# Altium project PCB_BALAM_21.PrjPcb
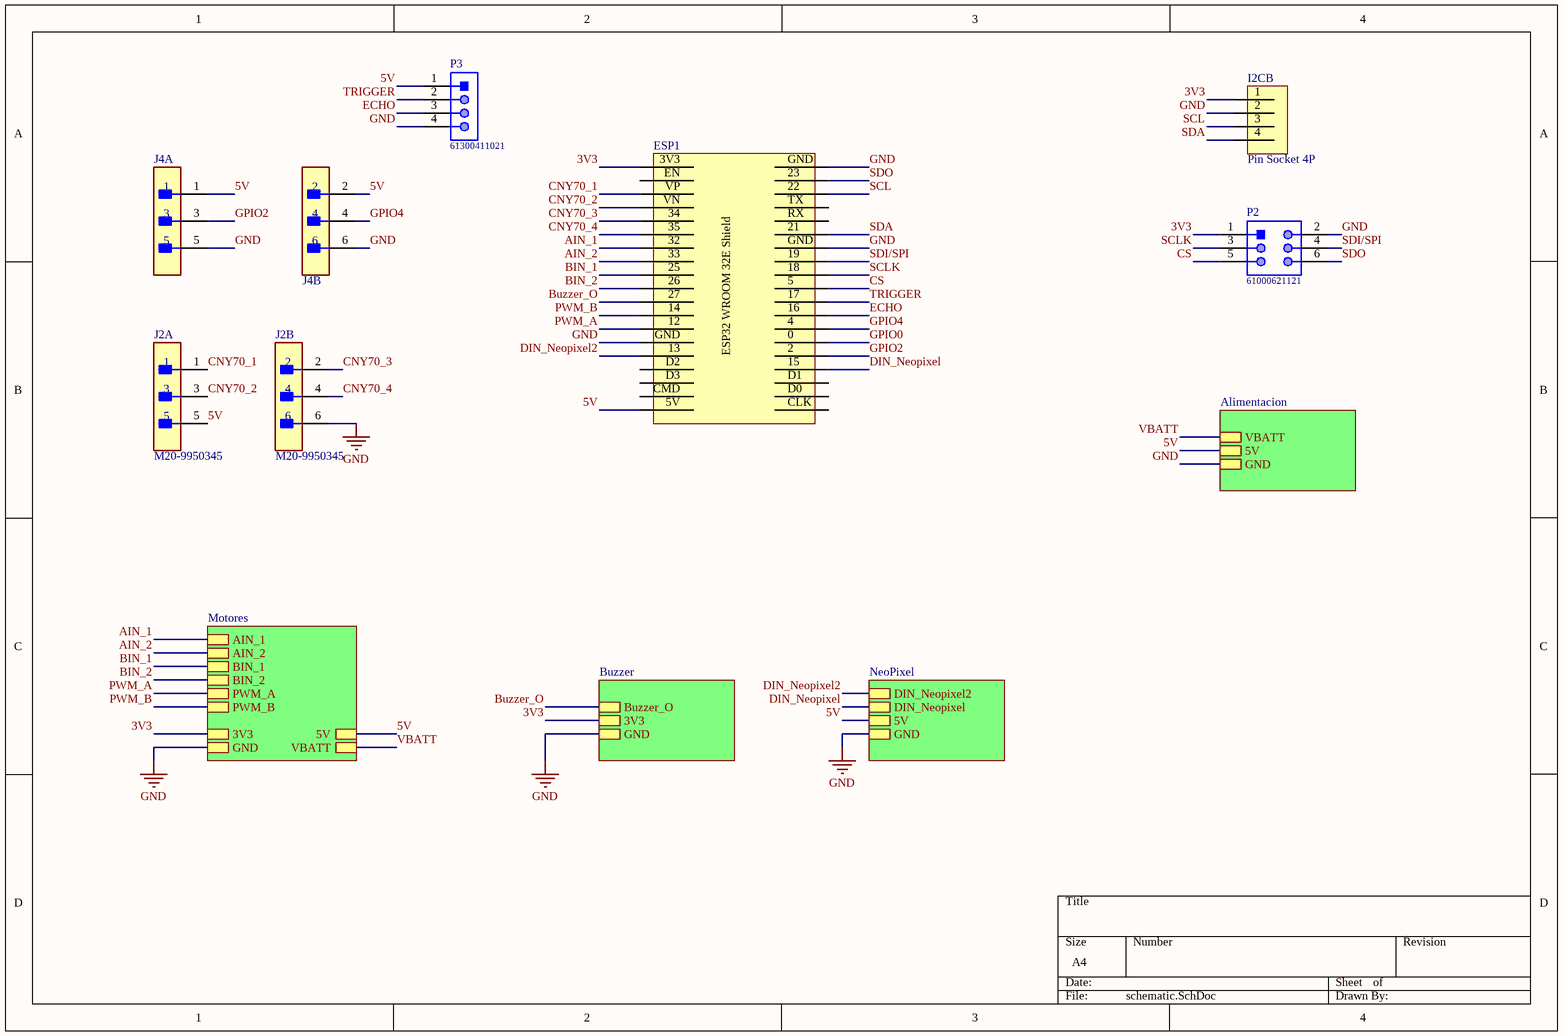
[diagram p0: schematic.SchDoc]
5 sheets, 46 parts. Net scope: hierarchical (ports join the sheet entries above them; power ports are global).
Board files: Balam_Board_2021_V2.PcbDoc, Balam_Board_2021.PcbDoc
Sheets:
  schematic.SchDoc
    NeoPixel = NeoPixel.SchDoc
    Buzzer = Buzzer.SchDoc
    Motores = Motores.SchDoc
    Alimentacion = Alimentacion.SchDoc

## Sheet schematic.SchDoc
size A4; SheetNumber: 1; SheetTotal: 5

### Parts
ESP1  Shield_ESP32_WR32E  [Shield_ESP32_WR32E]  (value not drawn)
I2C  Pin Socket 4P  [Pin Socket 4P]  (part B of 2)
J2  M20-9950345  [FP-M20-9950345-MFG]  (parts A,B of 2)
J4  M20-9950345  [FP-M20-9950345-MFG]  (value not drawn)  (parts A,B of 2)
P2  61000621121  [61000621121]
P3  61300411021  [61300411021]

### Sub-sheets
Alimentacion = Alimentacion.SchDoc: VBATT, GND, 5V
Buzzer = Buzzer.SchDoc: GND, 3V3, Buzzer_O
Motores = Motores.SchDoc: AIN_1, BIN_1, GND, AIN_2, PWM_B, 3V3, PWM_A, BIN_2, 5V, VBATT
NeoPixel = NeoPixel.SchDoc: DIN_Neopixel, GND, 5V, DIN_Neopixel2

### Nets
3V3: ESP1.3V3 I2C.1 P2.1 ; sheet Buzzer/3V3, sheet Motores/3V3
5V: ESP1.5V J2.5 J4.1 J4.2 P3.1 ; sheet NeoPixel/5V, sheet Motores/5V, sheet Alimentacion/5V
GND: ESP1.GND I2C.2 J2.6 J4.5 J4.6 P2.2 P3.4 ; sheet NeoPixel/GND, sheet Buzzer/GND, sheet Motores/GND, sheet Alimentacion/GND
AIN_1: ESP1.32 ; sheet Motores/AIN_1
AIN_2: ESP1.33 ; sheet Motores/AIN_2
BIN_1: ESP1.25 ; sheet Motores/BIN_1
BIN_2: ESP1.26 ; sheet Motores/BIN_2
Buzzer_O: ESP1.27 ; sheet Buzzer/Buzzer_O
CNY70_1: ESP1.VP J2.1
CNY70_2: ESP1.VN J2.3
CNY70_3: ESP1.34 J2.2
CNY70_4: ESP1.35 J2.4
CS: ESP1.5 P2.5
DIN_Neopixel: ESP1.15 ; sheet NeoPixel/DIN_Neopixel
DIN_Neopixel2: ESP1.13 ; sheet NeoPixel/DIN_Neopixel2
ECHO: ESP1.16 P3.3
GPIO0: ESP1.0
GPIO2: ESP1.2 J4.3
GPIO4: ESP1.4 J4.4
PWM_A: ESP1.12 ; sheet Motores/PWM_A
PWM_B: ESP1.14 ; sheet Motores/PWM_B
SCL: ESP1.22 I2C.3
SCLK: ESP1.18 P2.3
SDA: ESP1.21 I2C.4
SDI/SPI: ESP1.19 P2.4
SDO: ESP1.23 P2.6
TRIGGER: ESP1.17 P3.2
VBATT: sheet Motores/VBATT, sheet Alimentacion/VBATT

Not connected (* = marked no-connect by the designer): ESP1 CLK CMD D0 D1 D2 D3 EN RX TX

### Notes on the sheet
- (in symbol Shield_ESP32_WR32E) ESP32 WROOM 32E Shield

### Library data of the parts
I2C = Pin Socket 4P: Female Header 4 1 Straight，180degrees 2.54mm Through Hole,P=2.54mm Pin Header & Female Header RoHS
J2 J4 = CMP-15831-000002-1: CONN HEADER R/A 6POS 2.54MM; Manufacturer: Harwin; Conn Gender: Male; Number Of Contacts: 6; Conn Orientation: Right Angle; Current Rating: 3A; Device Class L2: Headers and Wire Housings; Temperature: -40°C to +105°C; Device Class L1: Connectors; RoHS: TRUE; Temperature Range Low: -40°C; ComponentLink2URL: https://cdn.harwin.com/pdfs/M20-995.pdf; Height: 5.28mm; Digikey Description: CONN HEADER R/A 6POS 2.54MM; Pitch: 2.54mm; Manufacturer Part Number: M20-9950345; Device Class L3: unset; Ipc Land Pattern Name: DFN400X400X80-14; Automotive: No; Octopart: https://octopart.com/m20-9950345-harwin-21265213; Category: Conn; Mouser Description: Headers & Wire Housings 03+03 DIL HORIZONTAL PIN HEADER GOLD HT; Package: 0; Number Of Rows: 2; Contact Material: Gold,Nickel; Lead Free: Yes; ComponentLink2Description: Datasheet; Temperature Range High: +105°C
P2 = CMP-1502-01024-1: SMT Vertical Pin Header WR-PHD, Pitch 2.54 mm, Dual Row, 6 pins; Manufacturer: Wurth Elektronik; Withstanding Voltage: 500VAC; Contact Resistance: 20mOhm; Working Voltage: 250VAC; Gender: Male; Rated Current: 3A; Pin Number: 6; Pitch: 2.54mm; Part Number: 61000621121; Operating Temperature: -40to125degC; Mounting Technology: SMT; Packaging: Tube; Datasheet URL: https://katalog.we-online.de/em/datasheet/6100xx21121.pdf; Package Reference: 61000621121; Publisher: WurthElektronik; Row Number: Dual; Orientation: Vertical; Manufacturer URL: http://www.we-online.de
P3 = CMP-1502-01063-1: THT Angled Pin Header WR-PHD, Pitch 2.54 mm, Single Row, 4 pins; Manufacturer: Wurth Elektronik; Gender: Male; Pin Number: 4; Withstanding Voltage: 500VAC; Working Voltage: 250VAC; Contact Resistance: 20mOhm; Pitch: 2.54mm; Rated Current: 3A; Manufacturer URL: http://www.we-online.de; Mounting Technology: THT; Publisher: WurthElektronik; Operating Temperature: -40to105degC; Packaging: Bag; Row Number: Single; Package Reference: 61300411021; Part Number: 61300411021; Orientation: Angled; Datasheet URL: https://katalog.we-online.de/em/datasheet/6130xx11021.pdf

## Sheet NeoPixel.SchDoc
size A4; SheetNumber: 2; SheetTotal: 6
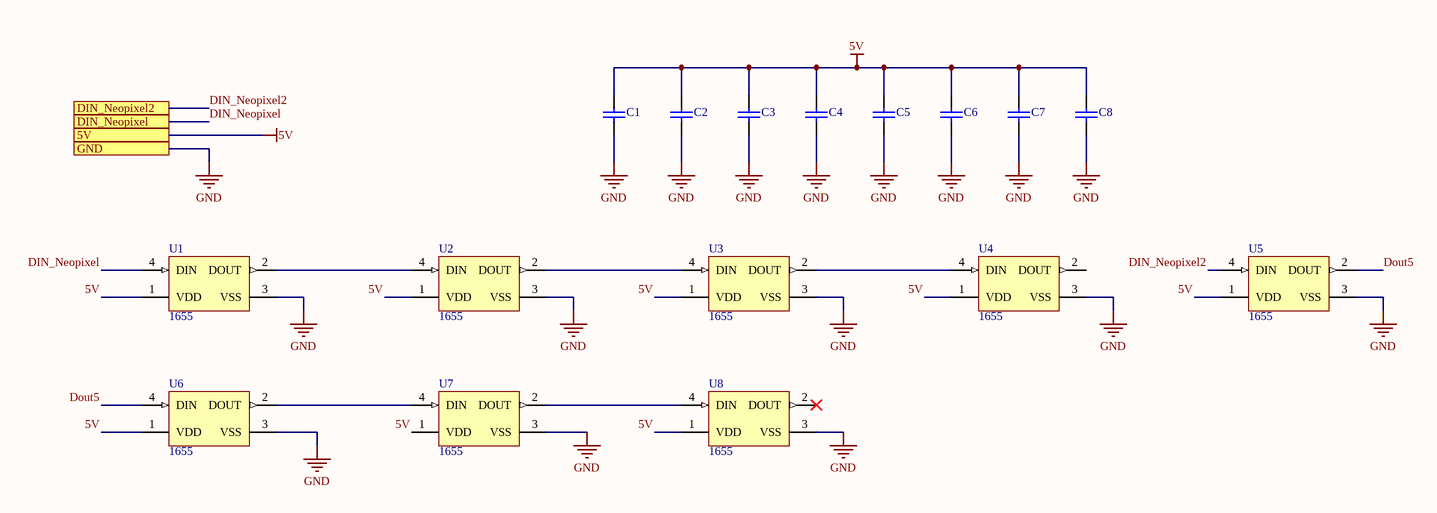
[diagram p1: NeoPixel.SchDoc]

### Parts
C1  C0805C105Z4VACTU  [CAPC2013X140X50ML20T25]  (value not drawn)
C2  C0805C105Z4VACTU  [CAPC2013X140X50ML20T25]  (value not drawn)
C3  C0805C105Z4VACTU  [CAPC2013X140X50ML20T25]  (value not drawn)
C4  C0805C105Z4VACTU  [CAPC2013X140X50ML20T25]  (value not drawn)
C5  C0805C105Z4VACTU  [CAPC2013X140X50ML20T25]  (value not drawn)
C6  C0805C105Z4VACTU  [CAPC2013X140X50ML20T25]  (value not drawn)
C7  C0805C105Z4VACTU  [CAPC2013X140X50ML20T25]  (value not drawn)
C8  C0805C105Z4VACTU  [CAPC2013X140X50ML20T25]  (value not drawn)
U1  1655  [ADA-RGB-1655_V]
U2  1655  [ADA-RGB-1655_V]
U3  1655  [ADA-RGB-1655_V]
U4  1655  [ADA-RGB-1655_V]
U5  1655  [ADA-RGB-1655_V]
U6  1655  [ADA-RGB-1655_V]
U7  1655  [ADA-RGB-1655_V]
U8  1655  [ADA-RGB-1655_V]

### Ports
5V, DIN_Neopixel, DIN_Neopixel2, GND

### Nets
5V: C1.2 C2.2 C3.2 C4.2 C5.2 C6.2 C7.2 C8.2 U1.1(VDD) U2.1(VDD) U3.1(VDD) U4.1(VDD) U5.1(VDD) U6.1(VDD) U7.1(VDD) U8.1(VDD) ; port 5V
GND: C1.1 C2.1 C3.1 C4.1 C5.1 C6.1 C7.1 C8.1 U1.3(VSS) U2.3(VSS) U3.3(VSS) U4.3(VSS) U5.3(VSS) U6.3(VSS) U7.3(VSS) U8.3(VSS) ; port GND
DIN_Neopixel: U1.4(DIN) ; port DIN_Neopixel
DIN_Neopixel2: U5.4(DIN) ; port DIN_Neopixel2
Dout5: U5.2(DOUT) U6.4(DIN)
NetU1_2: U1.2(DOUT) U2.4(DIN)
NetU2_2: U2.2(DOUT) U3.4(DIN)
NetU3_2: U3.2(DOUT) U4.4(DIN)
NetU6_2: U6.2(DOUT) U7.4(DIN)
NetU7_2: U7.2(DOUT) U8.4(DIN)

Not connected (* = marked no-connect by the designer): U4 2(DOUT); U8 2(DOUT)*

### Library data of the parts
C1-C8 = CMP-2007-03241-1: Manufacturer: Kemet; Part Number: C0805C105Z4VACTU
U1-U8 = CMP-2000-05026-1: Intelligent Control LED Integrated Light Source, 3.5 to 5.3 V, -25 to 80 degC, 4-Pin SMD, RoHS, Tape and Reel; Manufacturer: Adafruit-Industries-LLC; Number of LEDs: 10; Configuration: Discrete; Utilized LED: WS2812(5050); Datasheet URL: http://datasheet.octopart.com/ADA1655-Adafruit-Industries-datasheet-32028139.pdf; Series: Neopixel; Interface: -; Package Description: 4-Pin Surface Mount Device, Body 5 x 5 mm; Color: Red,Green,Blue(RGB); Category: Optoelectronics; Controller Type: -; Package Reference: 1655; Manufacturer URL: https://www.adafruit.com/; Mounting Type: SurfaceMount; Datasheet Version: May-13; Size / Dimension: 5.00mmLx5.00mmW; Family: Addressable,Specialty

## Sheet Buzzer.SchDoc
size A4; SheetNumber: 3; SheetTotal: 5
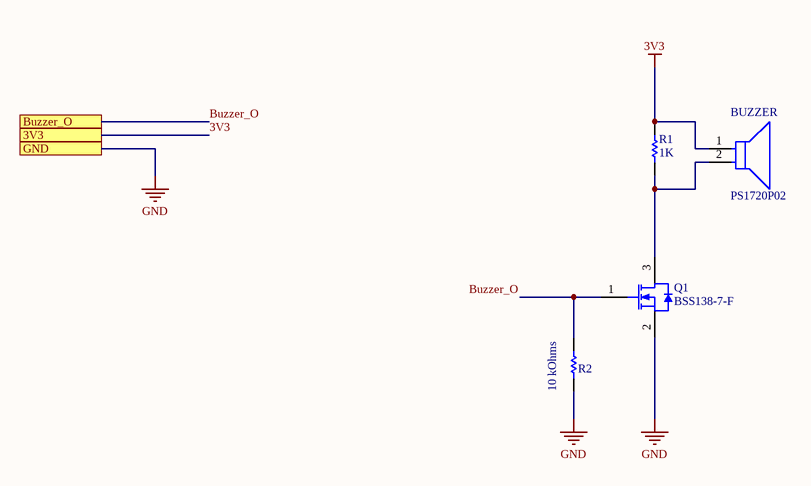
[diagram p2: Buzzer.SchDoc]

### Parts
BUZZER  PS1720P02  [FP-PS1720P02-MFG]
Q1  BSS138-7-F  [DIOD-SOT23-3_V]
R1  1K  [RESC0805(2012)_M]
R2  10 kOhms  [RESC2013X60X30ML20T20]

### Ports
3V3, Buzzer_O, GND

### Nets
3V3: BUZZER.1 R1.2 ; port 3V3
GND: Q1.2(S) R2.2 ; port GND
Buzzer_O: Q1.1(G) R2.1 ; port Buzzer_O
NetBUZZER_2: BUZZER.2 Q1.3(D) R1.1

### Library data of the parts
BUZZER = CMP-08413-000001-1: AUDIO PIEZO TRANSDUCER 30V TH; Manufacturer: TDK Corporation; Frequency: 2kHz; Standoff Height: 0.5mm; RoHS: TRUE; ComponentLink2URL: https://product.tdk.com/info/en/catalog/datasheets/piezoelectronic_buzzer_ps_en.pdf; ComponentLink2Description: Datasheet; Lead Free: Yes; Temperature Range High: +70°C; Category: Speak; Height: 8.3mm; Device Class L1: Electromechanical; Device Class L3: Buzzers; Package: 0; Mouser Description: Audio Indicators & Alerts Round 17mmx8mm 2 kHz Vin=3V; Manufacturer Part Number: PS1720P02; Digikey Description: AUDIO PIEZO TRANSDUCER 30V TH; Device Class L2: Audio Products; Temperature Range Low: -10°C; Automotive: No; Octopart: https://octopart.com/ps1720p02-tdk-154429; Temperature: -10°C to +70°C
Q1 = CMP-2000-04930-1: N-Channel Enhancement Mode Mosfet, 50 V, 0.2 A, -55 to 150 degC, 3-Pin SOT23, RoHS, Tape and Reel; Manufacturer: Diodes Inc; Brand: DiodesIncorporated; Unit Weight: 0.000282oz; Pd - Power Dissipation: 300mW; Id - Continuous Drain Current: 200mA; Rds On - Drain-Source Resistance: 3.5Ohms; Vgs - Gate-Source Voltage: 20V; Number of Channels: 1Channel; Vds - Drain-Source Breakdown Voltage: 50V; Transistor Type: 1N-Channel; Typical Turn-Off Delay Time: 20ns; Configuration: Single; Mounting Style: SMD/SMT; Height: 1mm; Package Description: 3-Pin Small Outline Transistor, Body 2.9 x 1.3 mm, Pitch 0.96 mm; Datasheet Version: Rev. 20-2, 11/2013; Minimum Operating Temperature: -55C; Package / Case: SOT-23-3; Channel Mode: Enhancement; Product: MOSFETSmallSignal; Packaging: Reel; Maximum Operating Temperature: +150C; Datasheet URL: https://datasheet.ciiva.com/8115/ds30144-8115344.pdf; Product Category: MOSFET; Width: 1.3mm; Technology: Si; Package Reference: SOT23-3; Manufacturer URL: http://www.diodes.com/; Transistor Polarity: N-Channel; Length: 2.9mm; Factory Pack Quantity: 3000; Series: BSS138; RoHS: True; Typical Turn-On Delay Time: 20ns
R1 = CMP-1013-00510-1: 1K 0.125W 1% 0805 (2012 Metric)  SMD; Case-Metric: 2012; Value: 1000.00 Ohm; Case-EIA: 0805; Tolerance: 1 %; Power: 0.125 W; Technology: SMT
R2 = CMP-2001-04657-1: 10 kOhms ±5% 0.25W, 1/4W Chip Resistor 0805 (2012 Metric) Automotive AEC-Q200, Moisture Resistant Thick Film; Part Number: RK73B2ATTD103J; Manufacturer: KOA Speer

## Sheet Motores.SchDoc
size A4; SheetNumber: 4; SheetTotal: 6
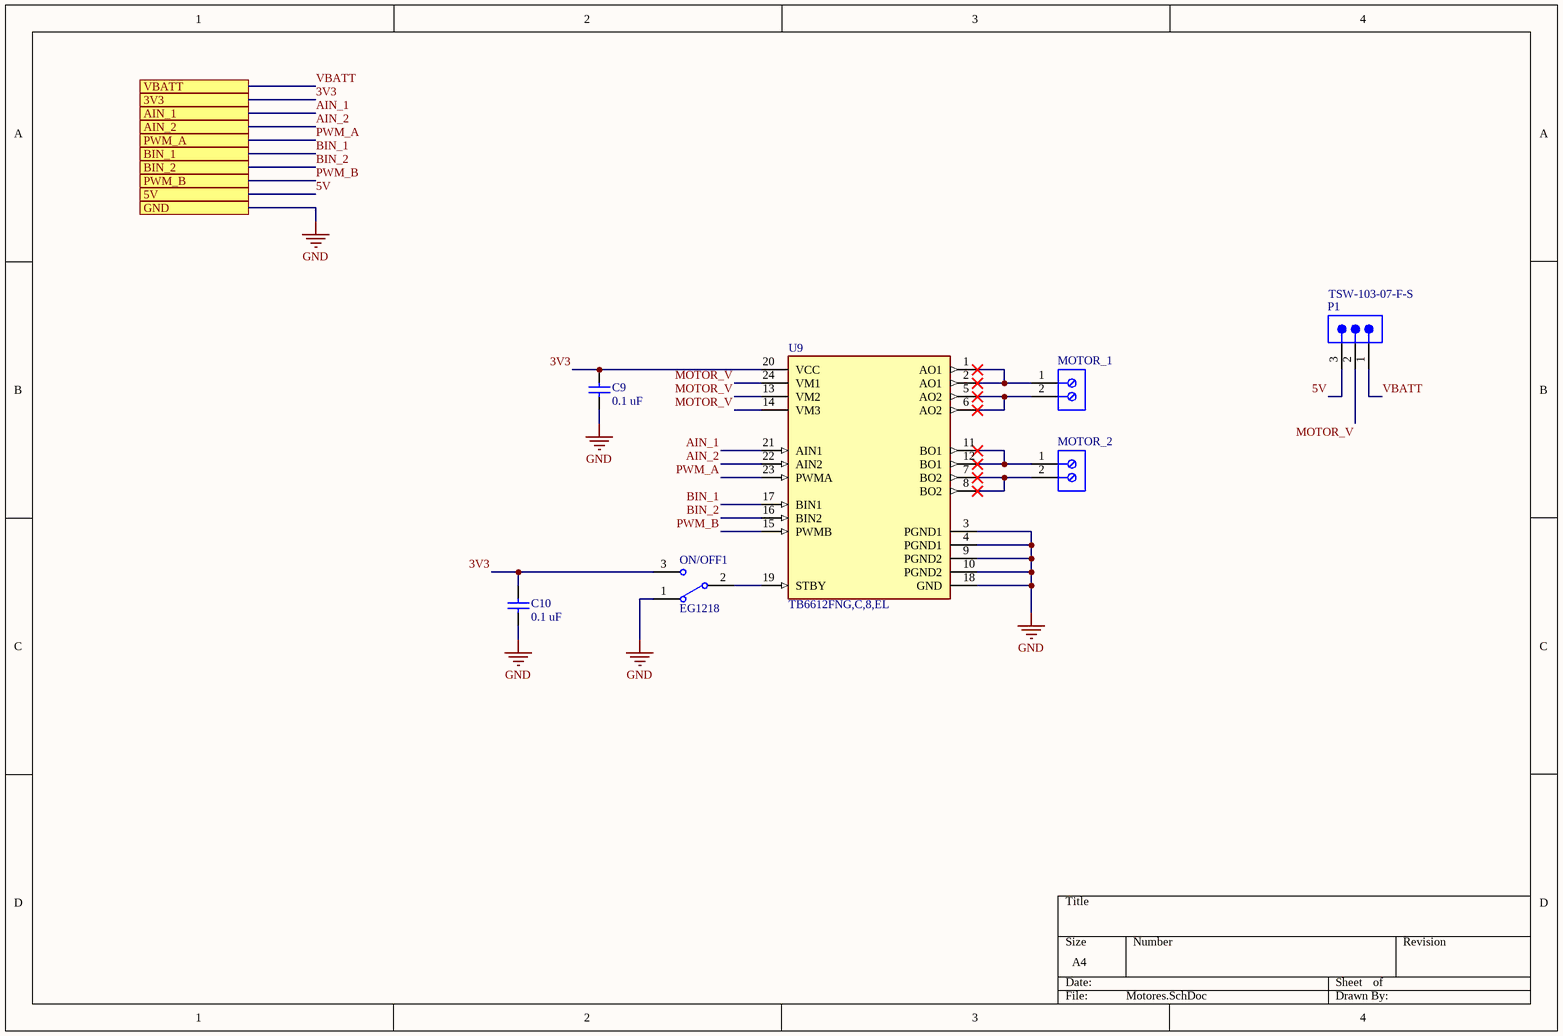
[diagram p3: Motores.SchDoc]

### Parts
C9  0.1 uF  [CAPC2013X94X50ML20T25]
C10  0.1 uF  [CAPC2013X94X50ML20T25]
MOTOR_1  691214110002  [691214110002]  (value not drawn)
MOTOR_2  691214110002  [691214110002]  (value not drawn)
ON/OFF1  EG1218  [ESWI-EG1218_V]
P1  TSW-103-07-F-S  [SMTC-TSW-103-07-X-S]
U9  TB6612FNG,C,8,EL  [FP-SSOP24-P-300-0_65A-IPC_A]

### Ports
3V3, 5V, AIN_1, AIN_2, BIN_1, BIN_2, GND, PWM_A, PWM_B, VBATT

### Nets
3V3: C9.2 C10.2 ON/OFF1.3 U9.20(VCC) ; port 3V3
5V: P1.3 ; port 5V
GND: C9.1 C10.1 ON/OFF1.1 U9.3(PGND1) U9.4(PGND1) U9.9(PGND2) U9.10(PGND2) U9.18(GND) ; port GND
AIN_1: U9.21(AIN1) ; port AIN_1
AIN_2: U9.22(AIN2) ; port AIN_2
BIN_1: U9.17(BIN1) ; port BIN_1
BIN_2: U9.16(BIN2) ; port BIN_2
MOTOR_V: P1.2 U9.13(VM2) U9.14(VM3) U9.24(VM1)
PWM_A: U9.23(PWMA) ; port PWM_A
PWM_B: U9.15(PWMB) ; port PWM_B
VBATT: P1.1 ; port VBATT
NetMOTOR_1_1: MOTOR_1.1 U9.1(AO1) U9.2(AO1)
NetMOTOR_1_2: MOTOR_1.2 U9.5(AO2) U9.6(AO2)
NetMOTOR_2_1: MOTOR_2.1 U9.11(BO1) U9.12(BO1)
NetMOTOR_2_2: MOTOR_2.2 U9.7(BO2) U9.8(BO2)
NetON/OFF1_2: ON/OFF1.2(COM) U9.19(STBY)

### Library data of the parts
C9 C10 = CMP-2000-05016-1: Chip Capacitor, Ceramic, 0.1 uF, 10%, 50 V, 0805, RoHS, Tape and Reel; Manufacturer: AVX; Rated Voltage: 50V; Capacitance: 100nF; Dielectric: X7R; Case Size/Dimension: 0805; Tolerance (%): ±10%; Datasheet URL: http://www.farnell.com/datasheets/319609.pdf; Datasheet Version: Sep-07; Manufacturer URL: http://www.avx.com/
MOTOR_1 MOTOR_2 = CMP-1502-02464-1: Serie 2141 - 3.50 mm Horizontal Entry Modular with Rising Cage Clamp WR-TBL, 2 pin; Manufacturer: Wurth Elektronik; Pin Number: 2; Pitch: 3.50mm; Datasheet URL: http://katalog.we-online.de/em/datasheet/6912141100xx.pdf; Packaging: Box; Mounting Technology: THT; Package Reference: 691214110002; Manufacturer URL: http://www.we-online.de; Part Number: 691214110002; Publisher: WurthElektronik; Operating Temperature: -40to105degC
ON/OFF1 = CMP-1696-00002-1: Slide Switch, 500 V, -20 to 70 degC, 3-Pin THD, RoHS; Case\Package: SOT-23-5; Output Current: 150 mA; Nominal Output Voltage: 3.3 V; Max Power Dissipation: 250 mW; Min Input Voltage: 4.3 V; Outputs: 1; Max Input Voltage: 8 V; Dropout Voltage: 300 mV; PackageDescription: 3-Pin Through Hole Device, Body 11.6 x 4 mm, Pitch 2.5 mm; ComponentLink1URL: http://www.e-switch.ch/en/; RoHSCompliant: true; Length: 3 mm; ComponentLink1Description: Manufacturer URL; Power Rating: 250 mW; Mount: Surface Mount; Max Operating Temperature: 85 degC; REACH SVHC: No SVHC; Radiation Hardening: No; Height: 1.3 mm; Pins: 5; Max Ouput Current: 150 mA; Output Voltage: 3.3 V; Width: 1.8 mm; Package Quantity: 3000; ComponentLink2URL: https://www.e-switch.com/system/asset/product_line/data_sheet/119/EG.pdf; Min Operating Temperature: -40 degC; ComponentLink2Description: Datasheet; DatasheetVersion: Oct-15; PackageReference: EG1218; Packaging: Tape and Reel
P1 = CMP-1024-00331-1: 0.025" SQ Post Header, Through-hole, Vertical, -55 to 125 degC, 2.54 mm Pitch, 3-Pin, Male, RoHS; Manufacturer: Samtec; Pitch: 2.54 mm; DatasheetVersion: F-214; ComponentLink1Description: Manufacturer URL; ComponentLink3URL: http://www.samtec.com/documents/webfiles/cpdf/TSW-XXX-XX-XXX-X-XX-XXX-MKT.pdf; Mounting Technology: Through-hole; PackageDescription: .025[0.64] SQ. Post Terminal Strip Assembly; Temperature Range: -55 to 125 degC; ComponentLink3Description: Package Specification; Orientation: Vertical; PartNumber: TSW-103-07-F-S; RoHS: True; PackageVersion: DM, 8/1988; ComponentLink2Description: Datasheet; ComponentLink1URL: http://www.samtec.com; ComponentLink2URL: http://www.samtec.com/documents/webfiles/pdf/TSW_TH.PDF; PackageReference: TSW-103-07-X-S
U9 = CMP-2100-03693-3: IC MOTOR DRIVER 2.7V-5.5V 24SSOP; Interface: Parallel; Output Current: 1A; Operating Supply Voltage: 3V; Max Supply Voltage: 5.5V; Min Supply Voltage: 2.7V; Number of Outputs: 2; Logic Function: AND; Min Operating Temperature: -20°C; Max Operating Temperature: 85°C; Number of Pins: 24; Package Quantity: 1; Packaging: Tape and Reel; Mount: Surface Mount; Case/Package: SSOP

## Sheet Alimentacion.SchDoc
size A4; SheetNumber: 6; SheetTotal: 6
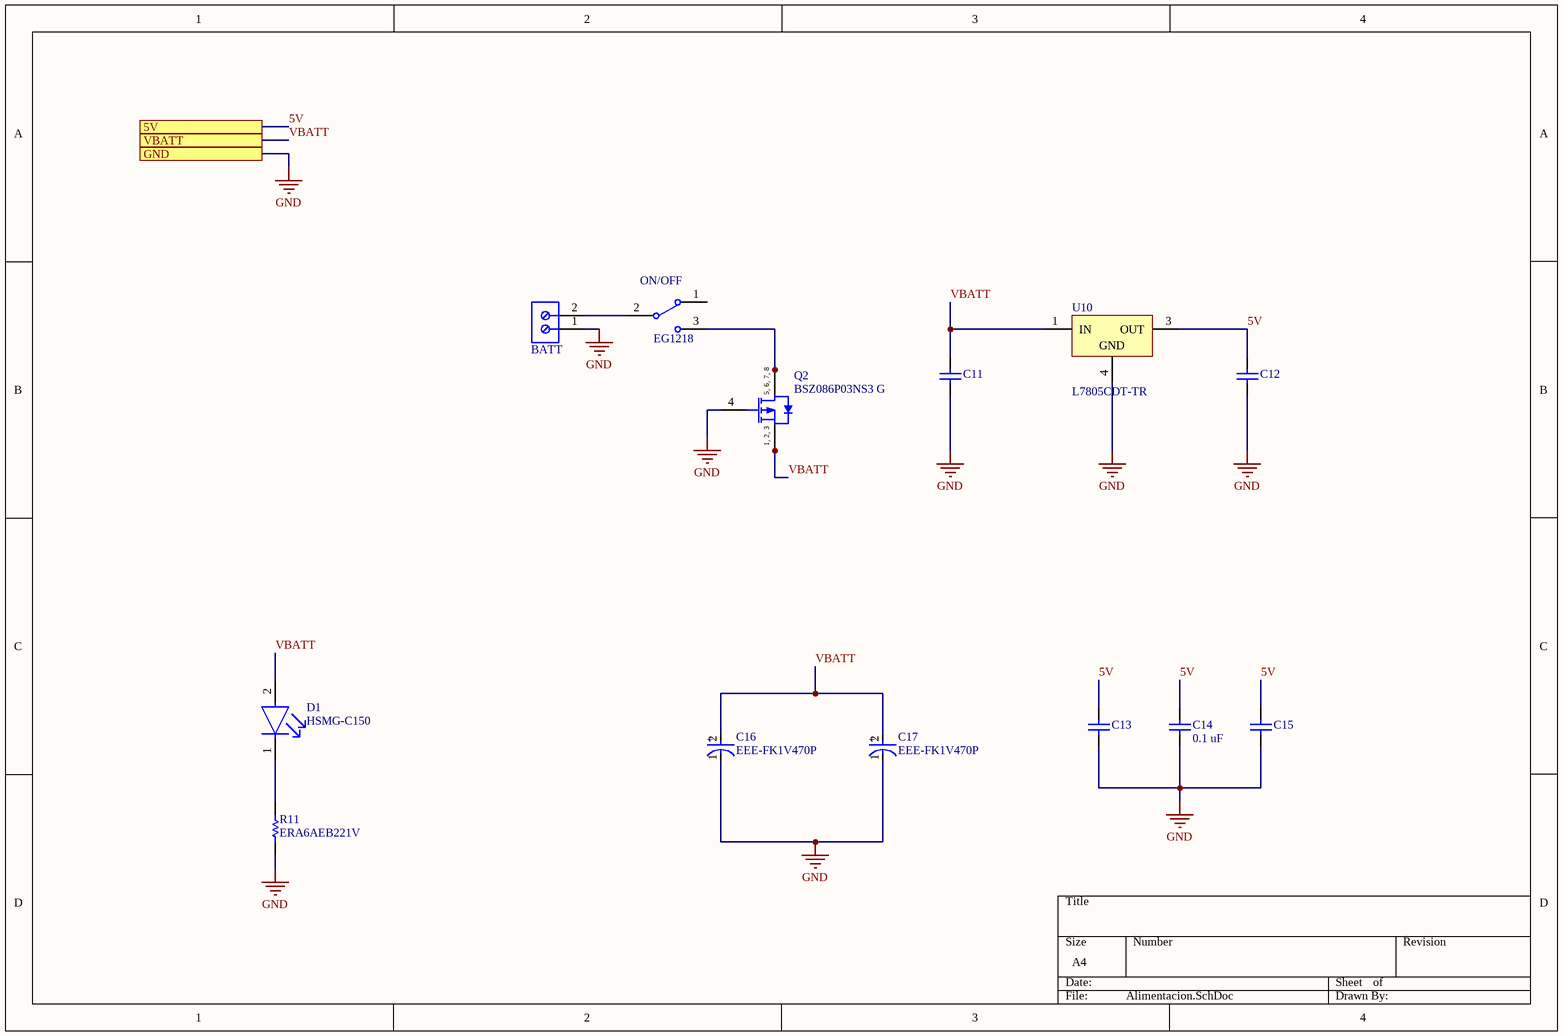
[diagram p4: Alimentacion.SchDoc]

### Parts
BATT  691214110002  [691214110002]  (value not drawn)
C11  C0805C106K4PACTU  [CAPC2013X140X50ML20T25]  (value not drawn)
C12  C0805C106K4PACTU  [CAPC2013X140X50ML20T25]  (value not drawn)
C13  C0805C106K4PACTU  [CAPC2013X140X50ML20T25]  (value not drawn)
C14  0.1 uF  [CAPC2013X94X50ML20T25]
C15  C0805C106K4PACTU  [CAPC2013X140X50ML20T25]  (value not drawn)
C16  EEE-FK1V470P  [FP-FK-D-MFG]
C17  EEE-FK1V470P  [FP-FK-D-MFG]
D1  HSMG-C150  [FP-HSMG-C150-MFG]
ON/OFF  EG1218  [ESWI-EG1218_V]
Q2  BSZ086P03NS3 G  [INF-PG-TSDSON-8-1_V]
R11  ERA6AEB221V  [RESC2013X60X40ML20T25]
U10  L7805CDT-TR  [TO-252_M]

### Ports
5V, GND, VBATT

### Nets
5V: C12.2 C13.2 C14.2 C15.2 U10.3(OUT) ; port 5V
GND: BATT.1 C11.1 C12.1 C13.1 C14.1 C15.1 C16.1(C) C17.1(C) Q2.4(GATE) R11.1 U10.4(GND) ; port GND
VBATT: C11.2 C16.2(A) C17.2(A) D1.2(A) Q2.1(SOURCE) Q2.2(SOURCE) Q2.3(SOURCE) U10.1(IN) ; port VBATT
NetBATT_2: BATT.2 ON/OFF.2(COM)
NetD1_1: D1.1(C) R11.2
NetON/OFF_3: ON/OFF.3 Q2.5(DRAIN) Q2.6(DRAIN) Q2.7(DRAIN) Q2.8(DRAIN)

Not connected (* = marked no-connect by the designer): ON/OFF 1

### Notes on the sheet
- (in symbol CMP-1099-00063-1) 5, 6, 7, 8; 1, 2, 3
- (in symbol CMP-05427-000002-1) +

### Library data of the parts
BATT = CMP-1502-02464-1: as MOTOR_1 on sheet Motores; Datasheet URL: http://katalog.we-online.de/em/datasheet/6912141100xx.pdf; Packaging: Box; Mounting Technology: THT; Package Reference: 691214110002; Manufacturer URL: http://www.we-online.de; Part Number: 691214110002; Publisher: WurthElektronik; Operating Temperature: -40to105degC
C11-C13 C15 = CMP-2007-03242-1: 10µF ±10% 16V Ceramic Capacitor X5R 0805 (2012 Metric); Part Number: CL21A106KOQNNNG
C14 = CMP-2000-05016-1: as C9 on sheet Motores; Case Size/Dimension: 0805; Tolerance (%): ±10%; Datasheet URL: http://www.farnell.com/datasheets/319609.pdf; Datasheet Version: Sep-07; Manufacturer URL: http://www.avx.com/
C16 C17 = CMP-05427-000002-1: CAP ALUM 47UF 20% 35V SMD; Manufacturer: Panasonic; Life: 2000Hours; Leakage Current: 16.45uA; Automotive Grade: Grade 2; Esr: 0.36Ω; Ripple Current: 240mA; Material: Aluminum; Dissipation Factor: 12%; Category: Cap; Device Class L3: Aluminum Electrolytic Capacitors; Value: 47uF; Device Class L2: Capacitors; ComponentLink2Description: Datasheet; Capacitance: 47uF; Temperature Range Low: -55°C; Device Class L1: Passive Components; Height: 6.1mm; Temperature Range High: +105°C; Lead Free: Yes; Octopart: https://octopart.com/eeefk1v470p-panasonic-4642848; Manufacturer Part Number: EEE-FK1V470P; Tolerance: 20%; Temperature: -55°C to +105°C; Voltage Rating: 35V; ComponentLink2URL: https://industrial.panasonic.com/cdbs/www-data/pdf/RDE0000/ABA0000C1181.pdf; Automotive: Yes; Mouser Description: Capacitor Aluminum Electrolytic 47uF 35 Volt 20% (6.3 X 5.8mm) Surface Mount 240mA 2000h 105C Automotive; RoHS: TRUE; Digikey Description: CAP ALUM 47UF 20% 35V SMD; Package: FK-D
D1 = CMP-2000-05061-2: LED GREEN DIFFUSED 1206 SMD; Manufacturer: Broadcom; Led Orientation: Top View; Max Junction Temp: +95°C; Peak Emmision Wavelength: 570nm; Viewing Angle: 170°; Wavelength: 572nm; Reverse Voltage: 5V; Luminous Intensity: 15mcd; Forward Voltage: 2.2V; Power Dissipation: 65mW; Forward Current: 20mA; ComponentLink2Description: Datasheet; Lead Free: Yes; Temperature Range Low: -40°C; Package: HSMG-C150; Digikey Description: LED GREEN DIFFUSED 1206 SMD; Mouser Description: LED Uni-Color Green 570nm 2-Pin Chip LED T/R; Manufacturer Part Number: HSMG-C150; Temperature Range High: +85°C; Device Class L1: Optoelectronics; Colour: Green; Category: Diode; Device Class L3: unset; RoHS: TRUE; Height: 1.2mm; ComponentLink2URL: https://docs.broadcom.com/docs/AV02-0551EN; Device Class L2: LEDs; Automotive: No; Ipc Land Pattern Name: DIOCP320160X55; Octopart: https://octopart.com/hsmg-c150-broadcom-71131304; Temperature: -40°C to +85°C
ON/OFF = CMP-1696-00002-1: as ON/OFF1 on sheet Motores; PackageDescription: 3-Pin Through Hole Device, Body 11.6 x 4 mm, Pitch 2.5 mm; ComponentLink1URL: http://www.e-switch.ch/en/; RoHSCompliant: true; Length: 3 mm; ComponentLink1Description: Manufacturer URL; Power Rating: 250 mW; Mount: Surface Mount; Max Operating Temperature: 85 degC; REACH SVHC: No SVHC; Radiation Hardening: No; Height: 1.3 mm; Pins: 5; Max Ouput Current: 150 mA; Output Voltage: 3.3 V; Width: 1.8 mm; Package Quantity: 3000; ComponentLink2URL: https://www.e-switch.com/system/asset/product_line/data_sheet/119/EG.pdf; Min Operating Temperature: -40 degC; ComponentLink2Description: Datasheet; DatasheetVersion: Oct-15; PackageReference: EG1218; Packaging: Tape and Reel
Q2 = CMP-1099-00063-1: P-Channel OptiMOS P3 Power-Transistor, -30 V VDS, -40 A ID, -55 to 150 degC, PG-TSDSON-8-1, Reel, Green; Manufacturer: Infineon; RDS (on) (max): 8.6Â mOhm; Rth: 1.8Â K/W; QG: 43.2Â nC; VGS(th) (max): -1.9Â V; RthJC (max): 1.8 K/W; Green: TRUE; Pto t (max): 69Â W; ID (max): -40Â A; IDpuls (max): -160Â A; VDS (max): -30Â V; VGS(th) (min): -3.1Â V; ComponentLink1URL: http://www.infineon.com/; ComponentLink2URL: http://www.infineon.com/dgdl/BSZ086P03NS3+G_2.03.pdf?folderId=db3a304314dca38901154a7313d21a66&fileId=db3a30431ff9881501203d3a5e7d17a9; Mounting Technology: Surface Mount; PartNumber: BSZ086P03NS3 G; Packing: Reel; PackageVersion: Rev. 02, 09/2008; Halogen-free: TRUE; ComponentLink3URL: http://www.infineon.com/dgdl/BSZ240N12NS3+Rev2.0.pdf?folderId=db3a304313b8b5a60113cee8763b02d7&fileId=db3a30432a40a650012a42f3057a0038; PackageDescription: 8-Pin Plastic (Green) Thin Dual Small Outline Non-Leaded Package, 3.3 x 3.3 mm Body, 0.65 mm Pitch; PackageReference: PG-TSDSON-8-1; DatasheetVersion: Rev. 2.03; ComponentLink2Description: Datasheet; ComponentLink3Description: Package Specification; ComponentLink1Description: Manufacturer URL
R11 = CMP-2001-00612-1: Manufacturer: Panasonic; Part Number: ERA6AEB221V
U10 = CMP-0244-00216-1: Positive Voltage Regulator, 3-Pin DPAK, Tape and Reel; PackageVersion: 2011; PackageReference: TO-252; DatasheetVersion: 16/11/2011; PackageDescription: 3-Pin Transistor Outline Package 2.28 mm Pitch, 9.7 mm Lead Span (DPAK); ComponentLink1URL: http://www.st.com; ComponentLink2Description: Datasheet; ComponentLink1Description: Manufacturer URL; ComponentLink2URL: http://www.st.com/internet/com/TECHNICAL_RESOURCES/TECHNICAL_LITERATURE/DATASHEET/CD00000444.pdf

## Nets that join several sheets
3V3: schematic (ESP1.3V3 I2C.1 P2.1), Buzzer (BUZZER.1 R1.2), Motores (C9.2 C10.2 ON/OFF1.3 U9.20)
5V: schematic (5 pins), NeoPixel (16 pins), Motores (P1.3), Alimentacion (5 pins)
GND: schematic (7 pins), NeoPixel (16 pins), Buzzer (Q1.2 R2.2), Motores (8 pins), Alimentacion (11 pins)
AIN_1: schematic (ESP1.32), Motores (U9.21)
AIN_2: schematic (ESP1.33), Motores (U9.22)
BIN_1: schematic (ESP1.25), Motores (U9.17)
BIN_2: schematic (ESP1.26), Motores (U9.16)
Buzzer_O: schematic (ESP1.27), Buzzer (Q1.1 R2.1)
DIN_Neopixel: schematic (ESP1.15), NeoPixel (U1.4)
DIN_Neopixel2: schematic (ESP1.13), NeoPixel (U5.4)
PWM_A: schematic (ESP1.12), Motores (U9.23)
PWM_B: schematic (ESP1.14), Motores (U9.15)
VBATT: Motores (P1.1), Alimentacion (8 pins)